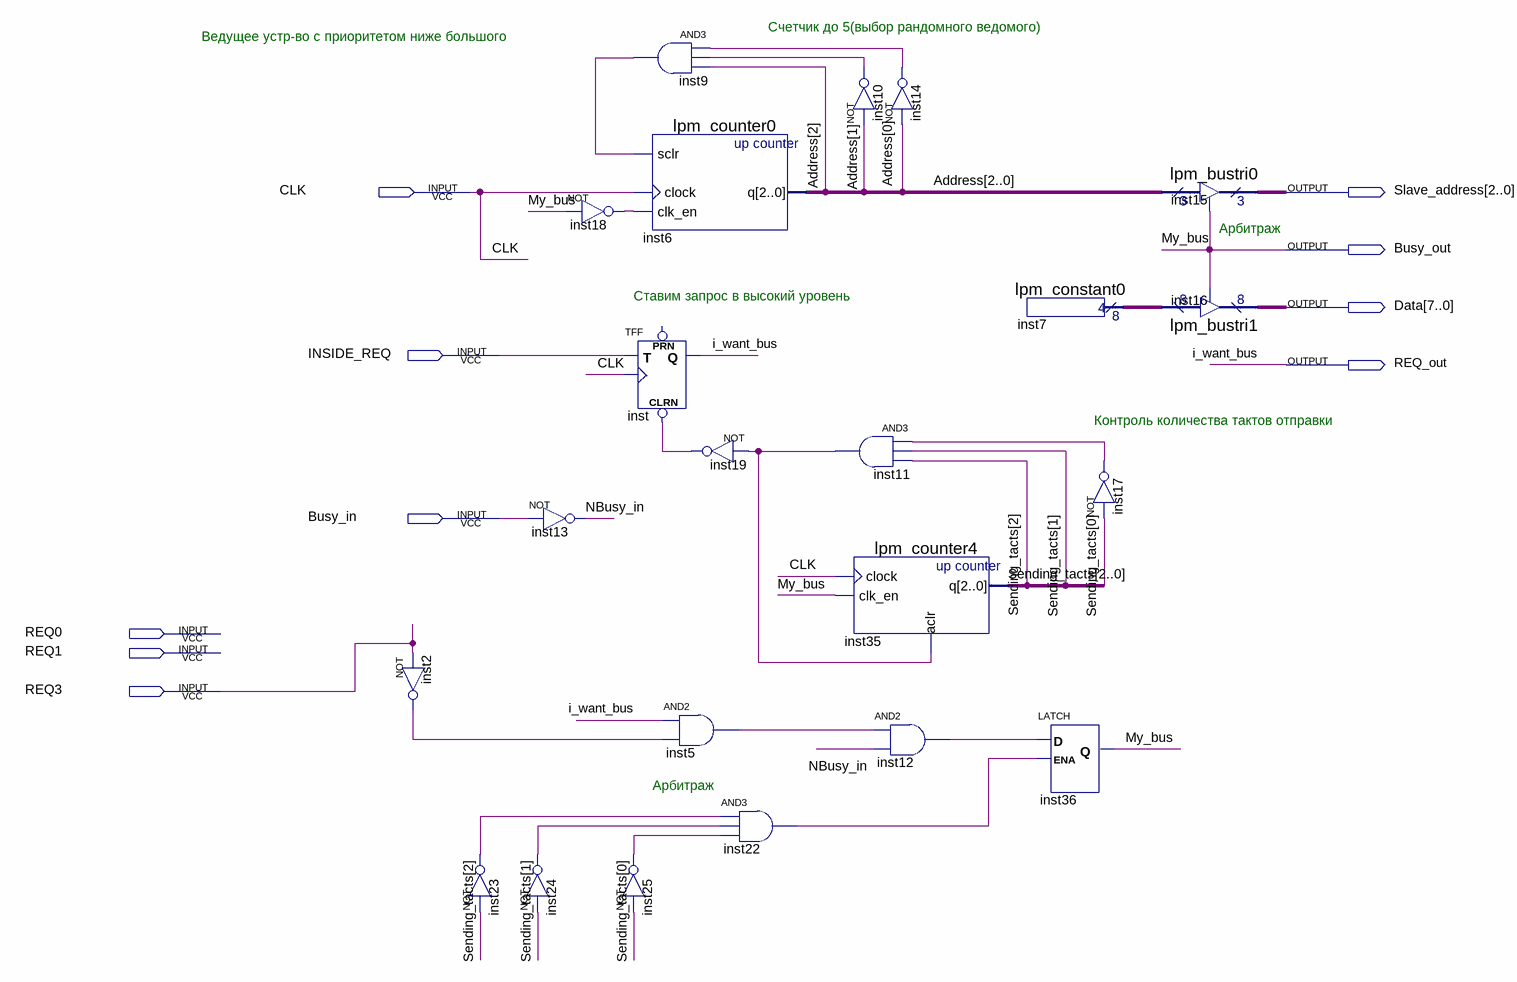
[diagram p0: schematic sheet]
// Quartus schematic Block3.bdf as structural Verilog: 22 symbols, 10 pins
module Block3 (
  input  CLK,
  input  INSIDE_REQ,
  input  Busy_in,
  input  REQ0,
  input  REQ1,
  input  REQ3,
  output [2:0] Slave_address,
  output Busy_out,
  output [7:0] Data,
  output REQ_out
);

  wire inst2_out, inst5_out, inst9_out, inst10_out, inst11_out, inst12_out, inst14_out, inst17_out,
       inst18_out, inst19_out, inst22_out, inst23_out, inst24_out, inst25_out, NBusy_in;
  wire [2:0] Address, Sending_tacts;
  wire [7:0] inst7_result;

  not inst2 (inst2_out, REQ3);
  not inst13 (NBusy_in, Busy_in);
  not inst23 (inst23_out, Sending_tacts[2]);
  not inst24 (inst24_out, Sending_tacts[1]);
  not inst18 (inst18_out, Busy_out);
  and inst9 (inst9_out, inst14_out, inst10_out, Address[2]);
  lpm_counter0 inst6 (.sclr(inst9_out), .clock(CLK), .clk_en(inst18_out), .q(Address));
  TFF inst (.CLRN(inst19_out), .T(INSIDE_REQ), .CLK(CLK), .Q(REQ_out));  // open: PRN
  and inst5 (inst5_out, REQ_out, inst2_out);
  not inst25 (inst25_out, Sending_tacts[0]);
  not inst19 (inst19_out, inst11_out);
  and inst22 (inst22_out, inst23_out, inst24_out, inst25_out);
  and inst11 (inst11_out, inst17_out, Sending_tacts[1], Sending_tacts[2]);
  lpm_counter4 inst35 (.clock(CLK), .clk_en(Busy_out), .aclr(inst11_out), .q(Sending_tacts));
  not inst10 (inst10_out, Address[1]);
  not inst14 (inst14_out, Address[0]);
  and inst12 (inst12_out, inst5_out, NBusy_in);
  lpm_constant0 inst7 (.result(inst7_result));
  LATCH inst36 (.D(inst12_out), .ENA(inst22_out), .Q(Busy_out));
  not inst17 (inst17_out, Sending_tacts[0]);
  lpm_bustri0 inst15 (.enabledt(Busy_out), .data(Address), .tridata(Slave_address));
  lpm_bustri1 inst16 (.enabledt(Busy_out), .data(inst7_result), .tridata(Data));

  // Other names for the same wires on the sheet: i_want_bus = REQ_out; My_bus = Busy_out

  // Notes on the sheet:
  //   Счетчик до 5(выбор рандомного ведомого)
  //   Ведущее устр-во с приоритетом ниже большого
  //   Арбитраж
  //   Ставим запрос в высокий уровень
  //   Контроль количества тактов отправки
  //   Арбитраж
endmodule
